# Altium schematic sheet Schematic.SchDoc
size 594 x 420 mm; Organization: Altium Limited; Address1: L3, 12a Rodborough Rd; Address2: Frenchs Forest; Address3: NSW; Address4: Australia 2086; Scale: 1:1; DocumentType: Схема электрическая принципиальная; FirstReferrence: АБВГ.123456.001
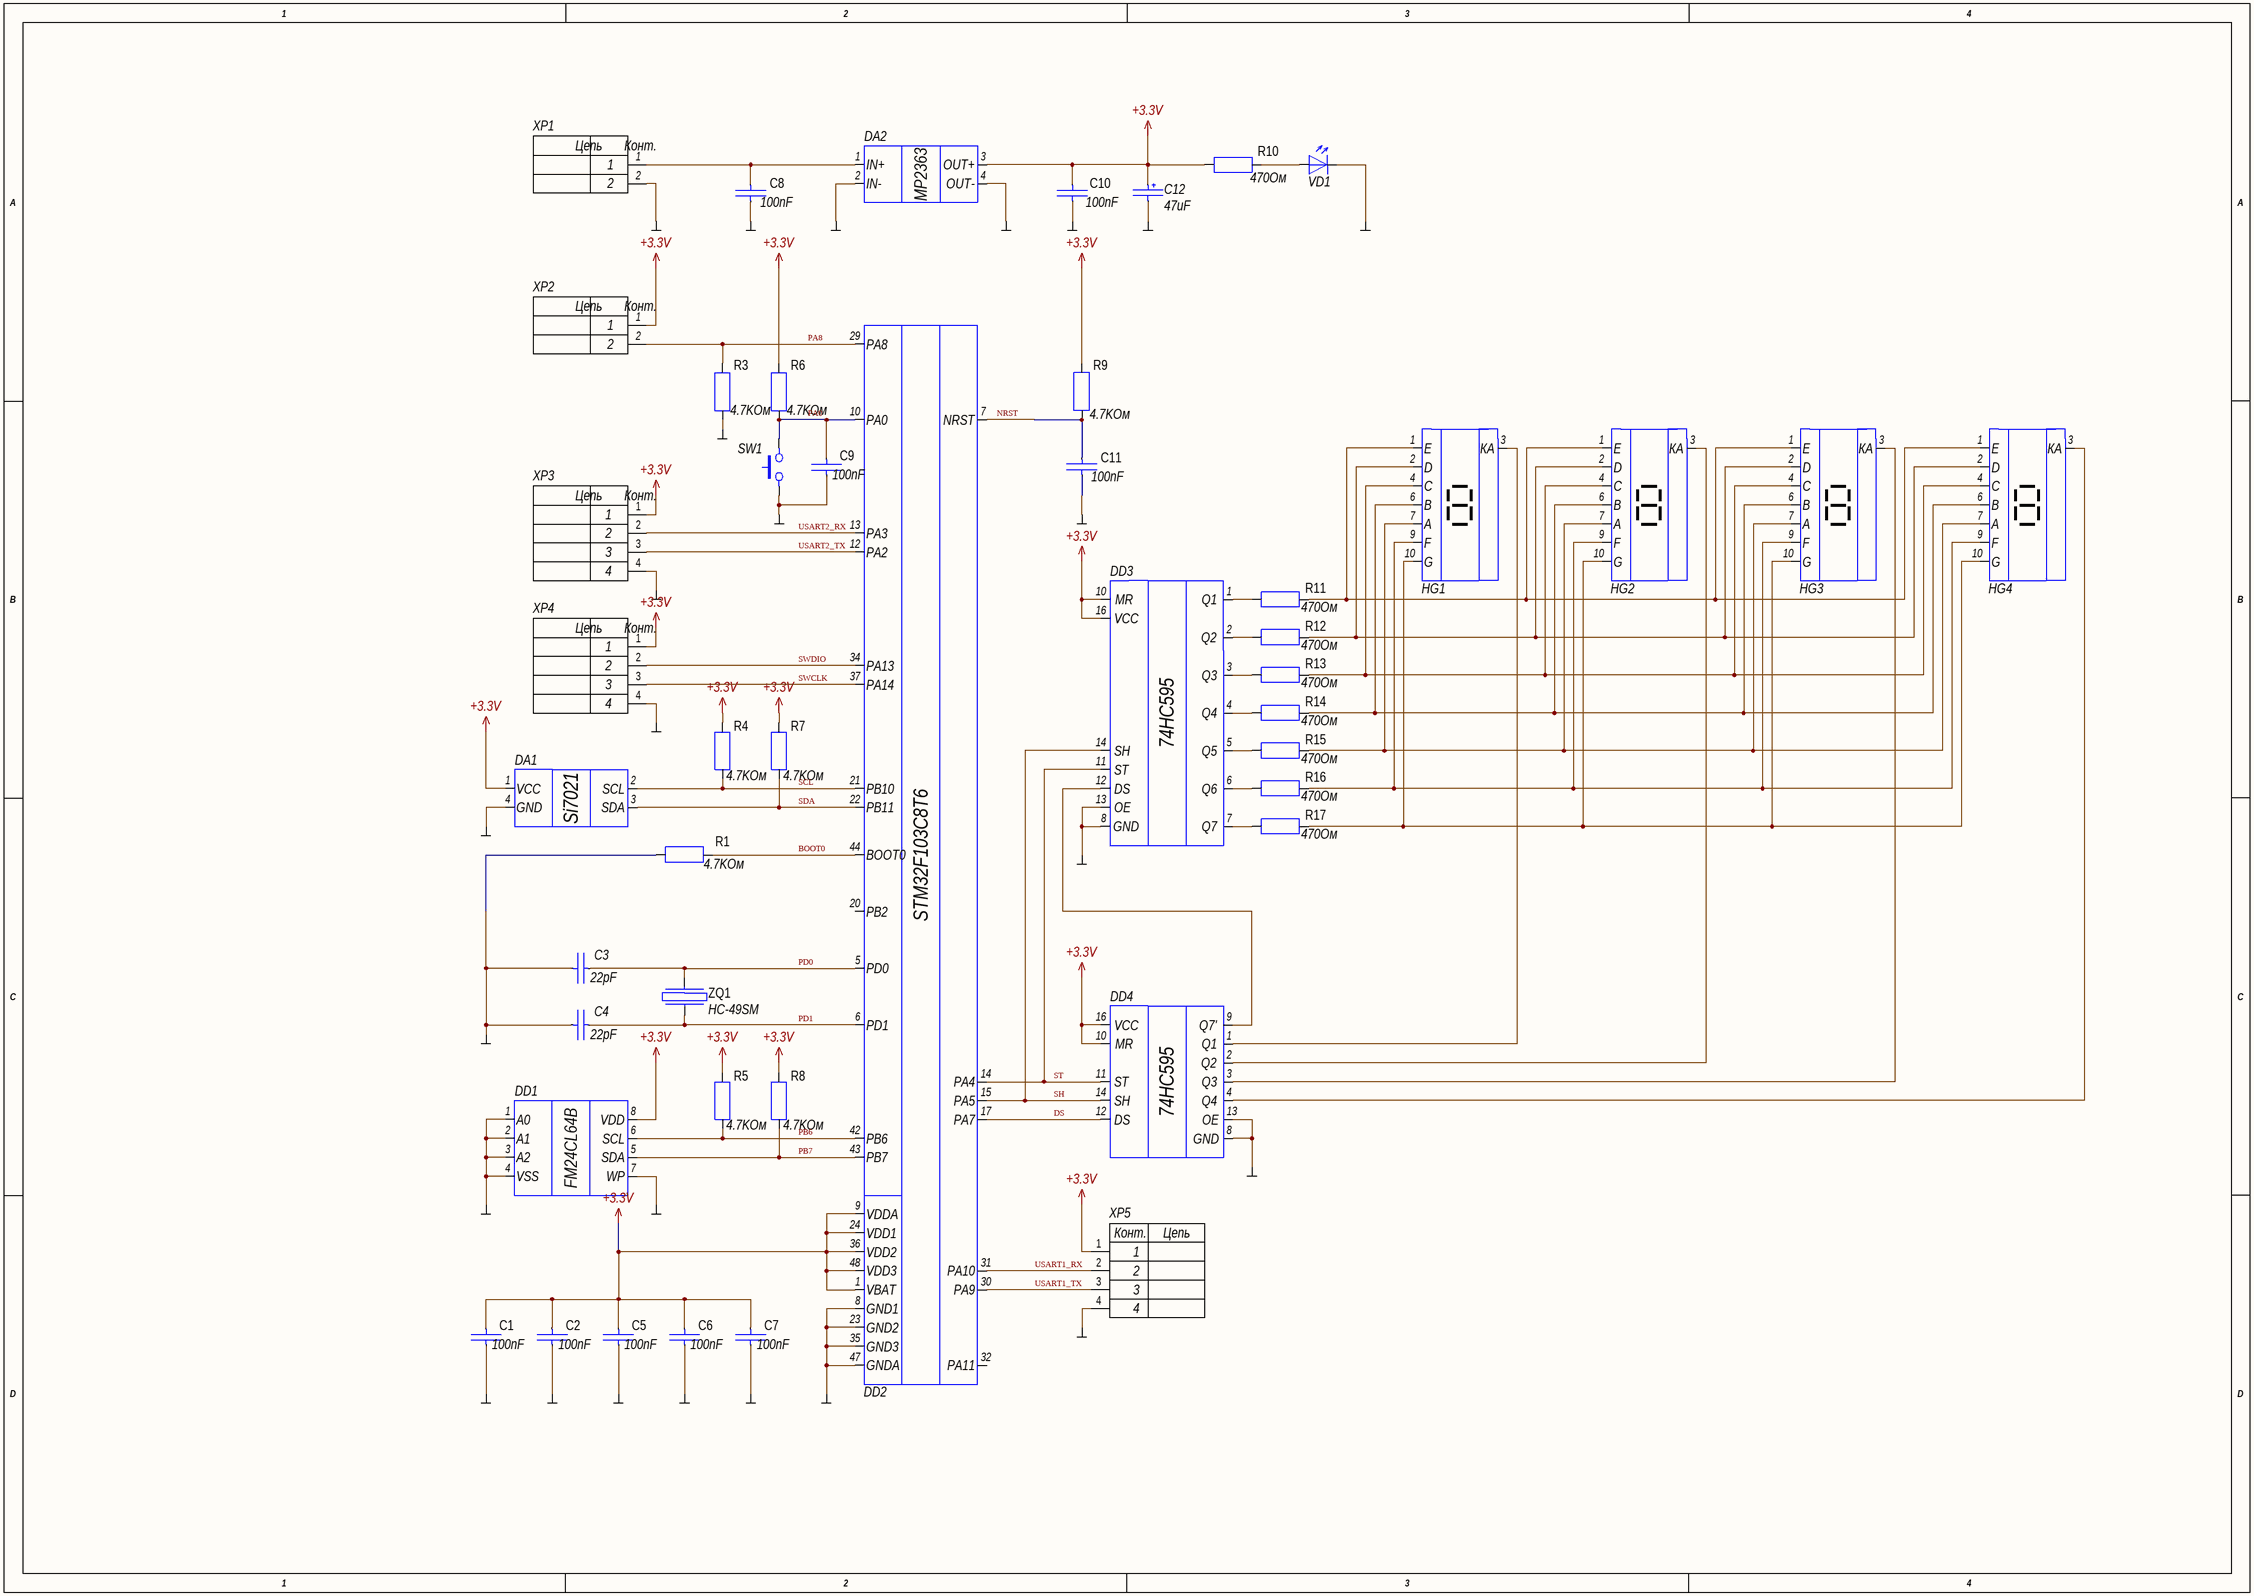
[diagram p0: Schematic.SchDoc]

## Parts
C1  100nF  [0805]
C2  100nF  [0805]
C3  22pF  [0805]
C4  22pF  [0805]
C5  100nF  [0805]
C6  100nF  [0805]
C7  100nF  [0805]
C8  100nF  [0805]
C9  100nF  [0805]
C10  100nF  [0805]
C11  100nF  [0805]
C12  47uF  [smdB]
DA1  Si7021  [Si7021-Board]  (value not drawn)
DA2  MP2363DN  [MP2363DN]  (value not drawn)
DD1  FM24CL64B  [SOIC-8]  (value not drawn)
DD2  Component_1  [Quad48]  (value not drawn)
DD3  74HC595_L  [74HC595]  (value not drawn)
DD4  74HC595_S  [74HC595]  (value not drawn)
HG1  7-Segment  [TOS-F2101AMRL-N-1-HF]  (value not drawn)
HG2  7-Segment  [TOS-F2101AMRL-N-1-HF]  (value not drawn)
HG3  7-Segment  [TOS-F2101AMRL-N-1-HF]  (value not drawn)
HG4  7-Segment  [TOS-F2101AMRL-N-1-HF]  (value not drawn)
R1  4.7KОм  [RES: 0.25w]
R3  4.7KОм  [RES: 0.25w]
R4  4.7KОм  [RES: 0.25w]
R5  4.7KОм  [RES: 0.25w]
R6  4.7KОм  [RES: 0.25w]
R7  4.7KОм  [RES: 0.25w]
R8  4.7KОм  [RES: 0.25w]
R9  4.7KОм  [RES: 0.25w]
R10  470Ом  [RES: 0.25w]
R11  470Ом  [RES: 0.25w]
R12  470Ом  [RES: 0.25w]
R13  470Ом  [RES: 0.25w]
R14  470Ом  [RES: 0.25w]
R15  470Ом  [RES: 0.25w]
R16  470Ом  [RES: 0.25w]
R17  470Ом  [RES: 0.25w]
SW1  Switch  [Button]  (value not drawn)
VD1  Diode  [TO-1608BC-BF]  (value not drawn)
XP1  X2  [DS-261A]  (value not drawn)
XP2  X2  [WB-02]  (value not drawn)
XP3  X4  [WB-04]  (value not drawn)
XP4  X4  [PLS-4]  (value not drawn)
XP5  X4  [WB-04]  (value not drawn)
ZQ1  HC-49SM  [HC-49SM]

## Nets
+3.3V: C1.2 C2.2 C5.2 C6.2 C7.2 C10.2 C12.1 DA1.1(VCC) DA2.3(OUT+) DD1.8(VDD) DD2.1(VBAT) DD2.9(VDDA) DD2.24(VDD1) DD2.36(VDD2) DD2.48(VDD3) DD3.10(MR) DD3.16(VCC) DD4.10(MR) DD4.16(VCC) R4.2 R5.2 R6.2 R7.2 R8.2 R9.2 R10.1 XP2.1 XP3.1 XP4.1 XP5.1
GND: C1.1 C2.1 C3.1 C4.1 C5.1 C6.1 C7.1 C8.1 C9.1 C10.1 C11.1 C12.2 DA1.4(GND) DA2.2(IN-) DA2.4(OUT-) DD1.1(A0) DD1.2(A1) DD1.3(A2) DD1.4(VSS) DD1.7(WP) DD2.8(GND1) DD2.23(GND2) DD2.35(GND3) DD2.47(GNDA) DD3.8(GND) DD3.13(OE) DD4.8(GND) DD4.13(OE) R1.2 R3.1 SW1.1 VD1.2 XP1.2 XP3.4 XP4.4 XP5.4
BOOT0: DD2.44(BOOT0) R1.1
DS: DD2.17(PA7) DD4.12(DS)
NRST: C11.2 DD2.7(NRST) R9.1
PA0: C9.2 DD2.10(PA0) R6.1 SW1.2
PA8: DD2.29(PA8) R3.2 XP2.2
PB6: DD1.6(SCL) DD2.42(PB6) R5.1
PB7: DD1.5(SDA) DD2.43(PB7) R8.1
PD0: C3.2 DD2.5(PD0) ZQ1.1
PD1: C4.2 DD2.6(PD1) ZQ1.2
SCL: DA1.2(SCL) DD2.21(PB10) R4.1
SDA: DA1.3(SDA) DD2.22(PB11) R7.1
SH: DD2.15(PA5) DD3.14(SH) DD4.14(SH)
ST: DD2.14(PA4) DD3.11(ST) DD4.11(ST)
SWCLK: DD2.37(PA14) XP4.3
SWDIO: DD2.34(PA13) XP4.2
USART1_RX: DD2.31(PA10) XP5.2
USART1_TX: DD2.30(PA9) XP5.3
USART2_RX: DD2.13(PA3) XP3.2
USART2_TX: DD2.12(PA2) XP3.3
NetC8_2: C8.2 DA2.1(IN+) XP1.1
NetDD3_1: DD3.1(Q1) R11.2
NetDD3_2: DD3.2(Q2) R12.2
NetDD3_3: DD3.3(Q3) R13.2
NetDD3_4: DD3.4(Q4) R14.2
NetDD3_5: DD3.5(Q5) R15.2
NetDD3_6: DD3.6(Q6) R16.2
NetDD3_7: DD3.7(Q7) R17.2
NetDD3_12: DD3.12(DS) DD4.9(Q7')
NetDD4_1: DD4.1(Q1) HG1.3(КА)
NetDD4_2: DD4.2(Q2) HG2.3(КА)
NetDD4_3: DD4.3(Q3) HG3.3(КА)
NetDD4_4: DD4.4(Q4) HG4.3(КА)
NetHG1_1: HG1.1(E) HG2.1(E) HG3.1(E) HG4.1(E) R11.1
NetHG1_2: HG1.2(D) HG2.2(D) HG3.2(D) HG4.2(D) R12.1
NetHG1_4: HG1.4(C) HG2.4(C) HG3.4(C) HG4.4(C) R13.1
NetHG1_6: HG1.6(B) HG2.6(B) HG3.6(B) HG4.6(B) R14.1
NetHG1_7: HG1.7(A) HG2.7(A) HG3.7(A) HG4.7(A) R15.1
NetHG1_9: HG1.9(F) HG2.9(F) HG3.9(F) HG4.9(F) R16.1
NetHG1_10: HG1.10(G) HG2.10(G) HG3.10(G) HG4.10(G) R17.1
NetR10_2: R10.2 VD1.1

Not connected (* = marked no-connect by the designer): DD2 20(PB2) 32(PA11)

## Notes on the sheet
- Перв. примен.
- Справ. №
- Подп. и дата
- Инв. № дубл.
- Взам. инв. №
- Разраб.
- Изм.
- Лист
- № докум.
- Подп.
- Дата
- Лит.
- Масса
- Масштаб
- Пров.
- Т.контр.
- Листов
- Инв. № подл.
- Утв.
- Н.контр.
- 2.106-A2
- Копировал
- Формат А2
- (in symbol 74HC595_L) 74HC595
- (in symbol 74HC595_S) 74HC595
- (in symbol Component_1) STM32F103C8T6
- (in symbol MP2363DN) MP2363
- (in symbol X2) Цепь; Конт.
- (in symbol X4) Конт.; Цепь

## Library data of the parts
C1 C2 C5-C11 = CAP: 100nF
C3 C4 = CAP: 22pF
C12 = ECAP: 47uF 10V
R1 R3-R17 = Resistor